# EAGLE design tweeq-IB_Protoboard_v3 (EAGLE 6.4)
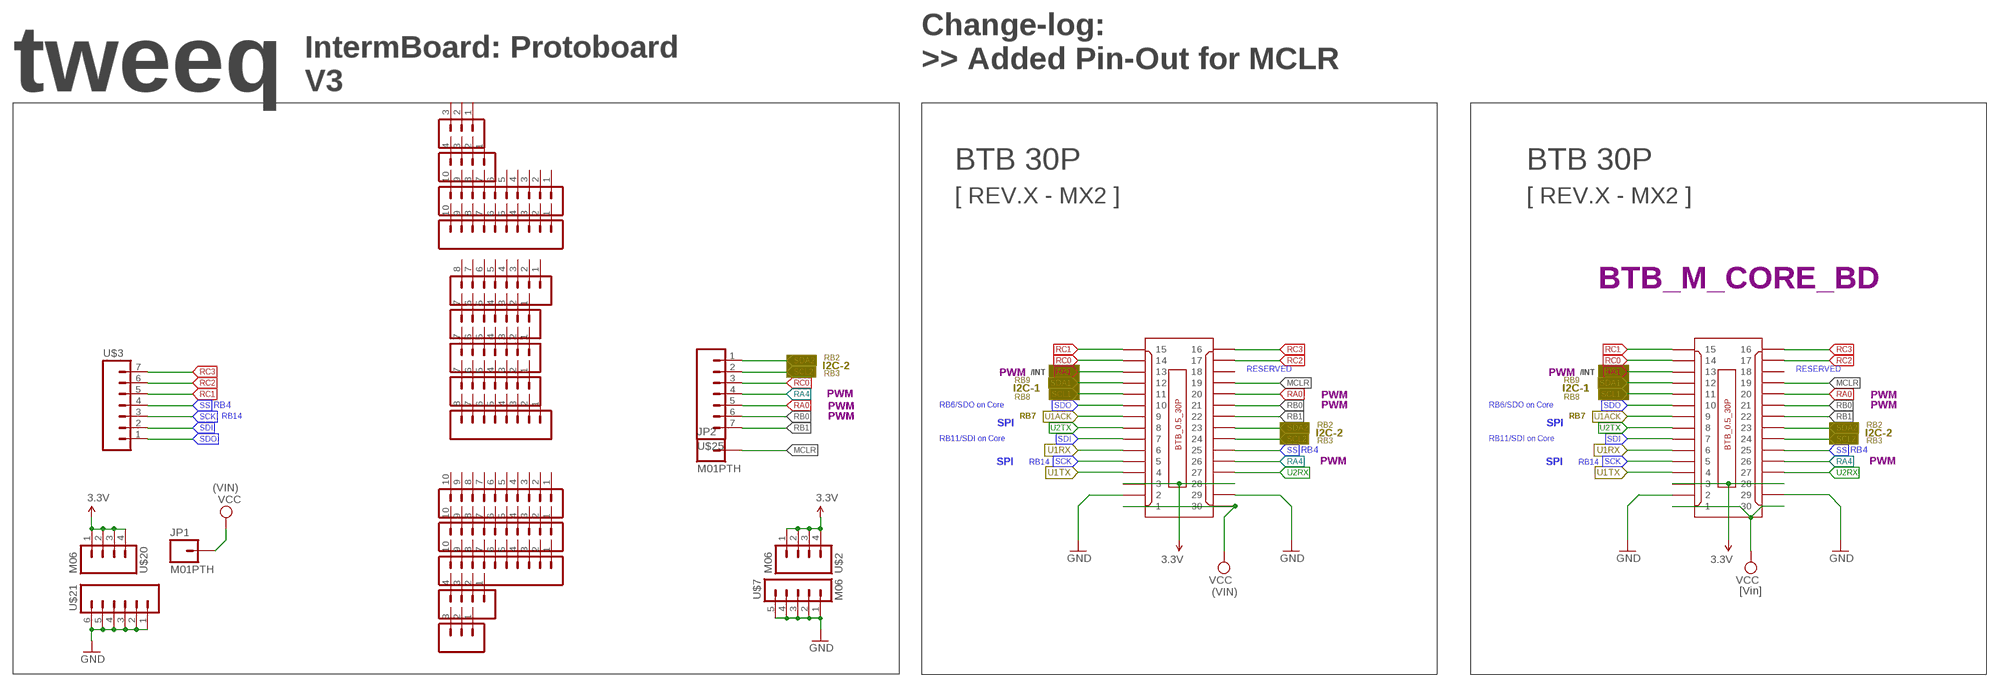
[diagram p0: schematic, sheet 1]

## Parts
JP1  M01PTH  [1X01]
JP2  M01PTH  [1X01]
U$2  M06  M04NS-CIRC  [1X04_NS_ROUND]
U$3  M072.54NOSILK  [1X07_NOSILK_]
U$4  BTB_CONN_30P/F  [BTB0.5-30F-3.0G]
U$5  M10-1/NS-SQ  M03NS-SQ  [1X03-NS-SQ]
U$7  M06  M05-1NS-SQ  [1X05-NS-SQ]
U$8  M09  M10-1/NS-SQ  [1X10-NS-SQ]
U$9  M09  M08-1/NS-SQ  [1X08-NS-SQ]
U$10  M09  M07/NS-SQ  [1X07-NS-SQ]
U$11  M09  M07/NS-SQ  [1X07-NS-SQ]
U$12  M09  M07/NS-SQ  [1X07-NS-SQ]
U$13  M10-10.1  M08-1/NS-SQ  [1X08-NS-SQ]
U$14  M10-1/NS-SQ  [1X10-NS-SQ]
U$15  M10-1/NS-SQ  [1X10-NS-SQ]
U$16  M10-1/NS-SQ  [1X10-NS-SQ]
U$17  M10-1/NS-SQ  M04NS-SQ  [1X04-NS-SQ]
U$18  M10-1/NS-SQ  [1X10-NS-SQ]
U$19  M10-1/NS-SQ  M03NS-SQ  [1X03-NS-SQ]
U$20  M06  M04NS-CIRC  [1X04_NS_ROUND]
U$21  M06NS-SQ  [1X06-NS-SQ]
U$22  BTB_CONN_30P/M  [BTB0.5-30M-3.0G]
U$23  M10-1/NS-SQ  M04NS-SQ  [1X04-NS-SQ]
U$25  M072.54NOSILK  [1X07_NOSILK_]

## Nets
3.3V: U$2.1 U$2.2 U$2.3 U$2.4 U$4.3 U$4.28 U$20.1 U$20.2 U$20.3 U$20.4 U$22.3 U$22.28
GND: U$4.2 U$4.29 U$7.1 U$7.2 U$7.3 U$7.4 U$7.5 U$21.1 U$21.2 U$21.3 U$21.4 U$21.5 U$21.6 U$22.2 U$22.29
MCLR: JP2.1 U$4.19 U$22.19
RA0: U$4.20 U$22.20 U$25.5
RA1: U$4.13 U$22.13
RA4: U$4.26 U$22.26 U$25.4
RB0: U$4.21 U$22.21 U$25.6
RB1: U$4.22 U$22.22 U$25.7
RC0: U$4.14 U$22.14 U$25.3
RC1: U$3.5 U$4.15 U$22.15
RC2: U$3.6 U$4.17 U$22.17
RC3: U$3.7 U$4.16 U$22.16
SCK: U$3.3 U$4.5 U$22.5
SCL1: U$4.11 U$22.11
SCL2: U$4.24 U$22.24 U$25.2
SDA1: U$4.12 U$22.12
SDA2: U$4.23 U$22.23 U$25.1
SDI: U$3.2 U$4.7 U$22.7
SDO: U$3.1 U$4.10 U$22.10
SS: U$3.4 U$4.25 U$22.25
U1ACK: U$4.9 U$22.9
U1RX: U$4.6 U$22.6
U1TX: U$4.4 U$22.4
U2RX: U$4.27 U$22.27
U2TX: U$4.8 U$22.8
VCC: JP1.1 U$4.1 U$4.30 U$22.1 U$22.30
Unconnected: U$4.18 U$5.1 U$5.2 U$5.3 U$8.1 U$8.2 U$8.3 U$8.4 U$8.5 U$8.6 U$8.7 U$8.8 U$8.9 U$8.10 U$9.1 U$9.2 U$9.3 U$9.4 U$9.5 U$9.6 U$9.7 U$9.8 U$10.1 U$10.2 U$10.3 U$10.4 U$10.5 U$10.6 U$10.7 U$11.1 U$11.2 U$11.3 U$11.4 U$11.5 U$11.6 U$11.7 U$12.1 U$12.2 U$12.3 U$12.4 U$12.5 U$12.6 U$12.7 U$13.1 U$13.2 U$13.3 U$13.4 U$13.5 U$13.6 U$13.7 U$13.8 U$14.1 U$14.2 U$14.3 U$14.4 U$14.5 U$14.6 U$14.7 U$14.8 U$14.9 U$14.10 U$15.1 U$15.2 U$15.3 U$15.4 U$15.5 U$15.6 U$15.7 U$15.8 U$15.9 U$15.10 U$16.1 U$16.2 U$16.3 U$16.4 U$16.5 U$16.6 U$16.7 U$16.8 U$16.9 U$16.10 U$17.1 U$17.2 U$17.3 U$17.4 U$18.1 U$18.2 U$18.3 U$18.4 U$18.5 U$18.6 U$18.7 U$18.8 U$18.9 U$18.10 U$19.1 U$19.2 U$19.3 U$22.18 U$23.1 U$23.2 U$23.3 U$23.4

## Notes on the sheet
- IntermBoard: Protoboard
- Change-log:
  >> Added Pin-Out for MCLR
- tweeq | V3
- BTB 30P | BTB 30P
- [ REV.X - MX2 ] | [ REV.X - MX2 ]
- BTB_M_CORE_BD
- RB2
- I2C-2 | PWM | /INT | PWM | /INT
- RESERVED | RESERVED
- RB3
- RB9 | RB9
- I2C-1
- I2C-1 | I2C-1
- PWM | PWM | PWM
- RB4 | RB8 | RB8
- PWM | RB6/SDO on Core | PWM | RB6/SDO on Core | PWM
- RB14 | RB7 | RB7
- PWM | SPI | SPI
- RB2 | RB2
- I2C-2 | I2C-2
- RB11/SDI on Core | RB11/SDI on Core | I2C-2
- RB3 | RB3
- RB4 | RB4
- SPI | SPI
- RB14 | PWM | RB14 | PWM | I2C-1
- (VIN)
- I2C-2
- (VIN) | [Vin]

## Library data of the parts
JP1 JP2 = AISCube:M01: Header 1 Standard 1-pin 0.1" header.
U$2 U$17 U$20 U$23 = AISCube:M04: 1x04 Pin Header Standard 2.54mm (0.1") header.
U$3 U$10-U$12 U$25 = AISCube:M07
U$4 U$22 = AISCube:BTB_CONN_30P: Board to Board Connector SMD 0.5mm Pitch 30 way - Dual Side (2x15) Total Mating height: 3.0mm
U$5 U$19 = AISCube:M03: Header 3 Standard 3-pin 0.1" header
U$7 = AISCube:M05-1: PIN HEADER Standard 0.1" header pin 5 pins - 1 way
U$8 U$14-U$16 U$18 = AISCube:M10-1: PIN HEADER Standard 0.1" Header Pins 10 pins - 1 way
U$9 U$13 = AISCube:M08-1: PIN HEADER Standard 0.1" Header Pins 8 pins - 1 way
U$21 = AISCube:M06

## Board
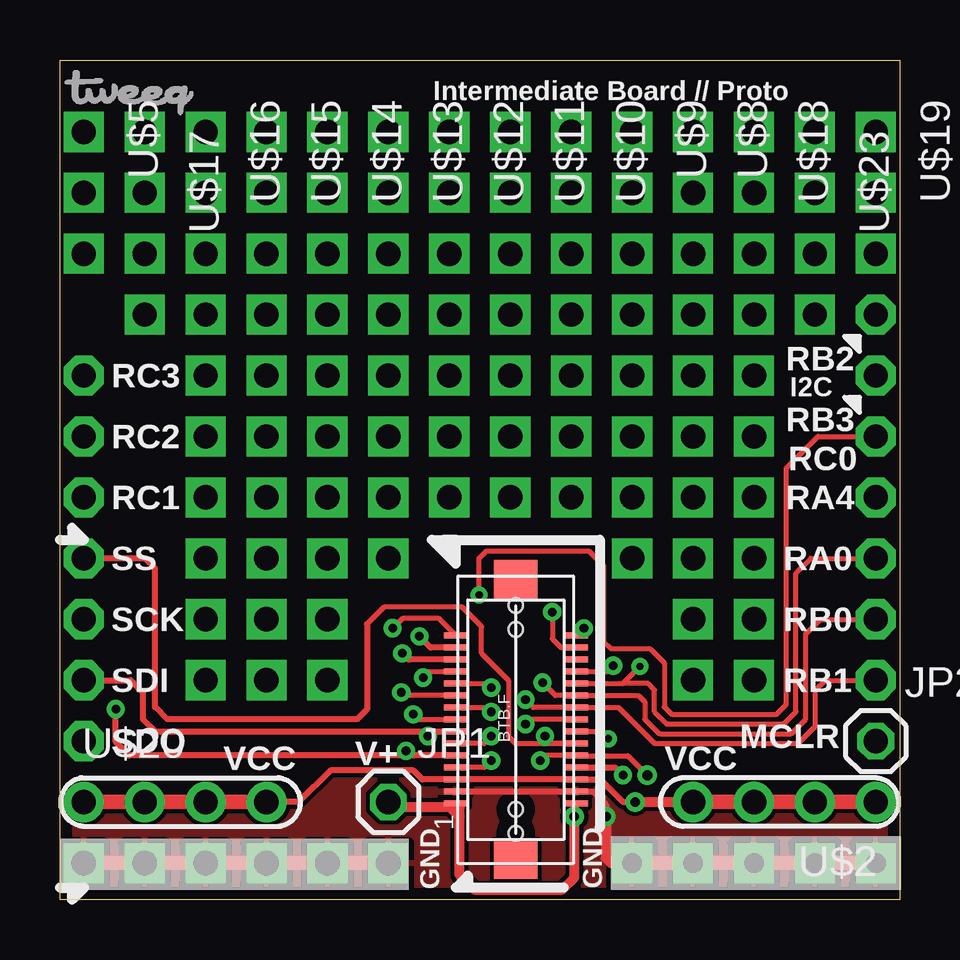
[diagram p1: board, top side]
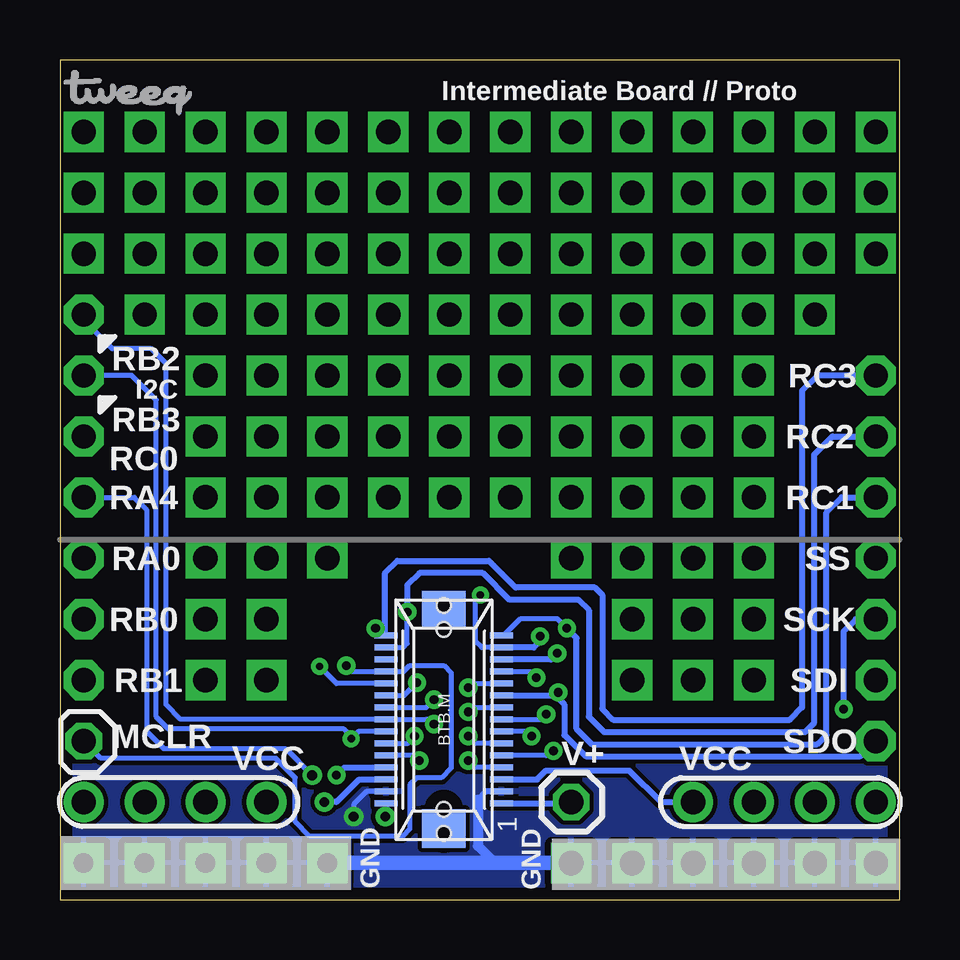
[diagram p2: board, bottom side, seen from below]

Size 35 x 35 mm. Coordinates in mm from the lower left corner, seen from the top.
Outline: 0,35 35,35 35,0 0,0 0,35
Copper layers (1*16): Top 0.0356mm / dielectric 1.5011mm / Bottom 0.0356mm
Design rules "AISCube": minimum track width 7mil, minimum drill 14mil, track to track 7mil, track to pad 7mil, pad to pad 7mil, via to via 7mil, smd to smd 0mil, copper to edge 20mil, drill to drill 8mil, minimum pad ring 10mil, minimum via ring 8mil, stop-mask expansion 4mil, vias tented up to drill 32mil, thermal gap 10mil

### Footprints (pad centres in the part's own frame; a part is rotated, then mirrored left to right if it is on the bottom)
1X01 = drill 1.016 pad 1.524 octagon: 1 0,0
1X04_NS_ROUND = drill 1.016 pad 1.676: 1 0,0; 2 2.54,0; 3 5.08,0; 4 7.62,0
1X07_NOSILK_ = drill 1.016 pad 1.676 octagon: 1 0,0; 2 2.54,0; 3 5.08,0; 4 7.62,0; 5 10.16,0; 6 12.7,0; 7 15.24,0
BTB0.5-30F-3.0G = smd 0.25 x 1: 1 -3.495,2.49; 2 -2.995,2.49; 3 -2.495,2.49; 4 -1.995,2.49; 5 -1.495,2.49; 6 -0.995,2.49; 7 -0.495,2.49; 8 0.005,2.49; 9 0.505,2.49; 10 1.005,2.49; 11 1.505,2.49; 12 2.005,2.49; 13 2.505,2.49; 14 3.005,2.49; 15 3.505,2.49; 16 3.505,-2.51; 17 3.005,-2.51; 18 2.505,-2.51; 19 2.005,-2.51; 20 1.505,-2.51; 21 1.005,-2.51; 22 0.505,-2.51; 23 0.005,-2.51; 24 -0.495,-2.51; 25 -0.995,-2.51; 26 -1.495,-2.51; 27 -1.995,-2.51; 28 -2.495,-2.51; 29 -2.995,-2.51; 30 -3.495,-2.51 | smd 1.6 x 1.8: P$1 -5.845,0; P$2 5.855,0 | hole 0.6: -4.745,0; 4.755,0
1X03-NS-SQ = drill 1.016 pad 1.676 square: 1 0,0; 2 2.54,0; 3 5.08,0
1X05-NS-SQ = drill 0.813 pad 1.676 square: 1 0,0; 2 2.54,0; 3 5.08,0; 4 7.62,0; 5 10.16,0
1X10-NS-SQ = drill 1.016 pad 1.676 square: 1 0,0; 2 2.54,0; 3 5.08,0; 4 7.62,0; 5 10.16,0; 6 12.7,0; 7 15.24,0; 8 17.78,0; 9 20.32,0; 10 22.86,0
1X08-NS-SQ = drill 1.016 pad 1.676 square: 1 0,0; 2 2.54,0; 3 5.08,0; 4 7.62,0; 5 10.16,0; 6 12.7,0; 7 15.24,0; 8 17.78,0
1X07-NS-SQ = drill 1.016 pad 1.676 square: 1 0,0; 2 2.54,0; 3 5.08,0; 4 7.62,0; 5 10.16,0; 6 12.7,0; 7 15.24,0
1X04-NS-SQ = drill 1.016 pad 1.676 square: 1 0,0; 2 2.54,0; 3 5.08,0; 4 7.62,0
1X06-NS-SQ = drill 1.016 pad 1.676 square: 1 0,0; 2 2.54,0; 3 5.08,0; 4 7.62,0; 5 10.16,0; 6 12.7,0
BTB0.5-30M-3.0G = smd 0.25 x 0.95: 1 -3.495,-2.41; 2 -2.995,-2.41; 3 -2.495,-2.41; 4 -1.995,-2.41; 5 -1.495,-2.41; 6 -0.995,-2.41; 7 -0.495,-2.41; 8 0.005,-2.41; 9 0.505,-2.41; 10 1.005,-2.41; 11 1.505,-2.41; 12 2.005,-2.41; 13 2.505,-2.41; 14 3.005,-2.41; 15 3.505,-2.41; 16 3.505,2.41; 17 3.005,2.41; 18 2.505,2.41; 19 2.005,2.41; 20 1.505,2.41; 21 1.005,2.41; 22 0.505,2.41; 23 0.005,2.41; 24 -0.495,2.41; 25 -0.995,2.41; 26 -1.495,2.41; 27 -1.995,2.41; 28 -2.495,2.41; 29 -2.995,2.41; 30 -3.495,2.41 | smd 1.6 x 1.8: P$1 -4.545,0; P$2 4.555,0 | hole 0.6: -3.745,0; 3.755,0

### Placement (x,y rotation side)
JP1  13.69,4.06 0 top
JP2  34.01,6.6 0 top
U$1  [TWEEQ-LOGO-S]  0.21,32.7 0 top
U$2  34.01,4.06 180 top
U$3  0.99,6.6 90 top
U$4  19,7.5 90 top
U$5  0.99,32 270 top
U$7  34.01,1.52 180 top
U$8  26.39,32 270 top
U$9  23.85,32 270 top
U$10  21.31,32 270 top
U$11  18.77,32 270 top
U$12  16.23,32 270 top
U$13  13.69,32 270 top
U$14  11.15,32 270 top
U$15  8.61,32 270 top
U$16  6.07,32 270 top
U$17  3.53,32 270 top
U$18  28.93,32 270 top
U$19  34.01,32 270 top
U$20  0.99,4.06 0 top
U$21  0.99,1.52 0 top
U$22  19,7.5 90 bottom
U$23  31.47,32 270 top
U$24  [TWEEQ-LOGO-S]  34.85,32.7 0 bottom
U$25  34.01,24.38 270 top

### Tracks (layer width: path | path; a pad name or v marks a point on that pad's centre or on a via)
3.3V  (via drill 0.41)
  Top 0.254: v23.98,4.06 23.47,4.06 22.86,4.67 22.53,5 U$4.28 U$4.3 15.11,5 14.73,5.38 11.28,5.38 9.96,4.06 U$20.4
  Top 0.406: v23.98,4.06 U$2.4
  Top 0.61: U$2.1 U$2.2 U$2.3 U$2.4 | U$20.1 U$20.2 U$20.3 U$20.4
  Bottom 0.254: U$22.28 22.53,5 23.47,4.06 v23.98,4.06 | U$22.3 15.11,5 14.73,5.38 11.28,5.38 9.96,4.06 U$20.4
GND  (via drill 0.41)
  Top 0.254: v22.76,3.45 22.76,3.96 22.22,4.5 U$4.29 U$4.2
  Top 0.406: v22.76,3.45 22.76,1.73 22.96,1.52 U$7.5
  Top 0.61: U$21.1 U$21.2 U$21.3 U$21.4 U$21.5 U$21.6 | U$7.1 U$7.2 U$7.3 U$7.4 U$7.5
  Bottom 0.203: U$22.29 22.22,4.5 22.76,3.96 v22.76,3.45
  Bottom 0.254: U$22.2 17.24,4.5 17.58,4.17
  Bottom 0.406: 17.58,4.17 17.58,2.23 16.87,1.52
  Bottom 0.61: U$7.5 16.87,1.52 U$21.6
  pour Top: 0.1,34.85 34.85,34.85 34.85,0.2 0.1,0.2
  pour Bottom: 0.1,34.85 34.85,34.85 34.85,0.2 0.1,0.2
MCLR  (via drill 0.36)
  Top 0.203: U$4.19 22.82,9.51 v23.06,9.75
  Bottom 0.203: v23.06,9.75 22.82,9.51 U$22.19 20.67,9.51 20.42,9.75 19,9.75 18.69,9.45 18.69,5.49 19.1,5.08 20.12,5.08 20.42,4.78 20.42,2.95 20.73,2.64 24.59,2.64 25.2,3.25 25.2,5.08 26.01,5.89 33.3,5.89 JP2.1
RA0  (via drill 0.3)
  Top 0.203: U$22.20 U$4.20 23.37,9.01 23.47,9.01 | U$25.5 31.29,14.22 30.68,13.61 30.68,7.82 30.18,7.32 25.3,7.32 24.79,7.82 24.79,8.74 24.52,9.01 23.47,9.01 | 23.47,9.01 v24.18,9.72
  Bottom 0.203: U$22.20 23.47,9.01 v24.18,9.72
RA1  (via drill 0.36)
  Top 0.254: U$4.13 14.53,10.01 v14.28,10.26
  Bottom 0.254: v14.28,10.26 14.53,10.01 U$22.13
RA4  (via drill 0.36, 0.41)
  Top 0.203: v20.02,5.79 20.23,6 U$4.26 21.52,5.99 23.67,5.99 v24.49,5.18
  Bottom 0.203: v20.02,5.79 20.23,6 U$22.26 | U$25.4 31.9,16.76 31.39,16.26 31.39,7.01 30.68,6.3 25.6,6.3 v24.49,5.18
RB0  (via drill 0.36)
  Top 0.203: U$25.6 31.7,11.68 31.09,11.07 31.09,7.52 30.48,6.91 24.99,6.91 24.38,7.52 24.38,8.23 24.11,8.51 U$4.21 20.65,8.51 v20.12,9.04
  Bottom 0.203: U$22.21 20.65,8.51 v20.12,9.04
RB1  (via drill 0.36)
  Top 0.203: 21.49,8.03 U$4.22 | U$4.22 23.29,8.01 24.79,6.5 30.79,6.5 31.5,7.21 31.5,8.74 31.9,9.14 U$25.7 | U$4.22 19.73,8.01 v19.41,8.33
  Bottom 0.203: U$22.22 19.73,8.01 v19.41,8.33
RC0  (via drill 0.3, 0.36)
  Top 0.203: v17.48,12.7 17.48,14.22 17.78,14.53 22.05,14.53 22.66,13.92 22.66,10.77 22.96,10.46 24.59,10.46 25.2,9.86 25.2,8.03 25.5,7.72 29.87,7.72 30.28,8.13 30.28,17.98 31.6,19.3 U$25.3
  Top 0.254: U$4.14 15.45,10.51 v14.99,10.97
  Bottom 0.203: U$22.14 17.41,10.51 17.68,10.77 17.68,12.5 v17.48,12.7
  Bottom 0.254: v14.99,10.97 14.99,10.77 15.25,10.51 U$22.14
RC1  (via drill 0.36)
  Top 0.203: v13.87,11.31 14.28,11.72 15.8,11.72 U$4.15
  Bottom 0.203: U$22.15 U$4.15 15.8,11.72 14.28,11.72 v13.87,11.31
  Bottom 0.254: U$3.5 2.41,16.76 3.05,16.13 3.05,6.86 3.43,6.48 12.83,6.48 13.46,7.11 13.46,10.9 v13.87,11.31
RC2  (via drill 0.36)
  Top 0.203: v20.52,11.99 20.52,10.87 20.89,10.51 U$4.17
  Bottom 0.203: U$22.17 20.69,10.51 20.52,10.67 v20.52,11.99
  Bottom 0.254: U$3.6 2.79,19.3 3.56,18.54 3.56,7.37 3.94,6.99 12.32,6.99 12.95,7.62 12.95,12.06 13.39,12.5 16.26,12.5 17.37,13.61 20.02,13.61 20.52,13.11 v20.52,11.99
RC3  (via drill 0.36)
  Top 0.254: U$4.16 21.81,11.3 v21.84,11.3
  Bottom 0.254: U$3.7 3.43,21.84 4.06,21.21 4.06,8 4.57,7.49 11.94,7.49 12.39,7.95 12.39,12.7 12.7,13.01 16,13.01 17.12,14.12 20.93,14.12 21.46,13.59 21.46,11.06 U$22.16 21.55,11.01 v21.84,11.3
SCK  (via drill 0.36)
  Top 0.203: 14.72,6 v14.43,6.2
  Top 0.254: U$4.5 14.72,6 2.88,6 2.33,6.56 v2.33,7.93
  Bottom 0.203: v14.43,6.2 14.72,6 U$22.5
  Bottom 0.254: U$3.3 1.83,11.68 2.34,11.18 v2.34,7.95 v2.33,7.93
SCL1  (via drill 0.36)
  Top 0.203: U$4.11 17.82,9.01 v17.98,8.84
  Bottom 0.203: v17.98,8.84 17.82,9.01 U$22.11
SCL2  (via drill 0.3)
  Top 0.203: U$4.24 22.56,7 v22.86,6.71
  Bottom 0.203: U$25.2 32,21.84 30.99,20.83 30.99,7.62 30.48,7.11 23.16,7.11 22.86,6.81 v22.86,6.71 22.56,7 U$22.24
SDA1  (via drill 0.36)
  Top 0.203: v15.14,9.25 15.4,9.51 U$4.12
  Bottom 0.203: U$22.12 15.4,9.51 v15.14,9.25
SDA2  (via drill 0.36)
  Top 0.203: U$4.23 21.5,7.52 19.71,7.52 v19.41,7.32
  Bottom 0.203: U$25.1 34.01,24.16 32.82,22.96 31.19,22.96 30.58,22.35 30.58,8.13 29.97,7.52 21.5,7.52 | 21.5,7.52 21.42,7.52 U$22.23 21.4,7.52 19.71,7.52 v19.41,7.32 | 21.5,7.52 U$4.23
SDI  (via drill 0.36)
  Top 0.203: U$4.7 15.54,7 v15.34,6.81
  Top 0.254: U$3.2 2.95,9.14 3.45,8.64 3.45,7.52 3.97,7 U$4.7
  Bottom 0.203: v15.34,6.81 15.54,7 U$22.7
SDO  (via drill 0.36)
  Top 0.203: U$4.10 14.36,8.51 v14.22,8.64
  Bottom 0.203: v14.22,8.64 14.35,8.51
  Bottom 0.254: U$22.10 14.35,8.51 13.97,8.13 13.97,6.86 13.08,5.97 1.63,5.97 U$3.1
SS  (via drill 0.36)
  Top 0.203: U$22.25 20.52,6.5 v20.22,6.81 | U$22.25 20.73,6.5 20.72,6.5 19,6.5 18.69,6.81 18.69,9.14 17.58,10.26 17.58,11.38 16.76,12.19 13.51,12.19 12.8,11.48 | U$4.25 U$22.25
  Top 0.254: 12.8,11.48 12.8,7.92 12.39,7.52 4.47,7.52 3.96,8.03 3.96,13.82 3.56,14.22 U$3.4
  Bottom 0.203: U$22.25 20.52,6.5 v20.22,6.81
U1ACK  (via drill 0.36)
  Top 0.203: U$4.9 17.7,8.01 v17.98,7.82
  Bottom 0.203: v17.98,7.82 17.7,8.01 U$22.9
U1RX  (via drill 0.36)
  Top 0.203: v17.98,6.81 17.68,6.5 U$4.6
  Bottom 0.203: U$22.6 17.68,6.5 v17.98,6.81
U1TX  (via drill 0.36)
  Top 0.203: v17.98,5.79 17.7,5.5 U$4.4
  Bottom 0.203: 16.61,5.49 U$22.4 17.7,5.5 v17.98,5.79
U2RX  (via drill 0.36)
  Top 0.254: U$4.27 23.15,5.5 v23.47,5.18
  Bottom 0.254: v23.47,5.18 23.15,5.5 U$22.27
U2TX  (via drill 0.36)
  Top 0.203: v14.73,7.72 14.94,7.52 16.5,7.52 U$4.8
  Bottom 0.203: U$22.8 14.95,7.5 v14.73,7.72
VCC  (via drill 0.41)
  Top 0.254: 21.44,3.76 21.51,3.53 U$4.30 21.44,3.93 v21.44,3.45 | 16.66,3.85 U$4.1
  Top 0.406: 21.44,3.76 v21.44,3.45 21.44,0.91 20.93,0.41 17.27,0.41 16.66,1.02 16.66,3.45 | 16.66,3.45 16.66,3.85 16.66,3.86 | JP1.1 13.89,3.86 16.26,3.86 16.66,3.45
  Bottom 0.254: U$22.30 21.41,3.48 v21.44,3.45 | U$22.1 13.75,4 JP1.1

### Text on the board
tPlace: Intermediate Board // Proto | RB2 | I2C | RC3 | RB3 | RC2 | RC0 | RA4 | RC1 | RA0 | SS | RB0 | SCK | RB1 | SDI | MCLR | SDO | V+ | VCC | VCC | GND | GND
bPlace: Intermediate Board // Proto | RB2 | I2C | RC3 | RB3 | RC2 | RC0 | RA4 | RC1 | RA0 | SS | RB0 | SCK | RB1 | SDI | MCLR | SDO | V+ | VCC | VCC | GND | GND